# EAGLE design Reflect (EAGLE 6.3)
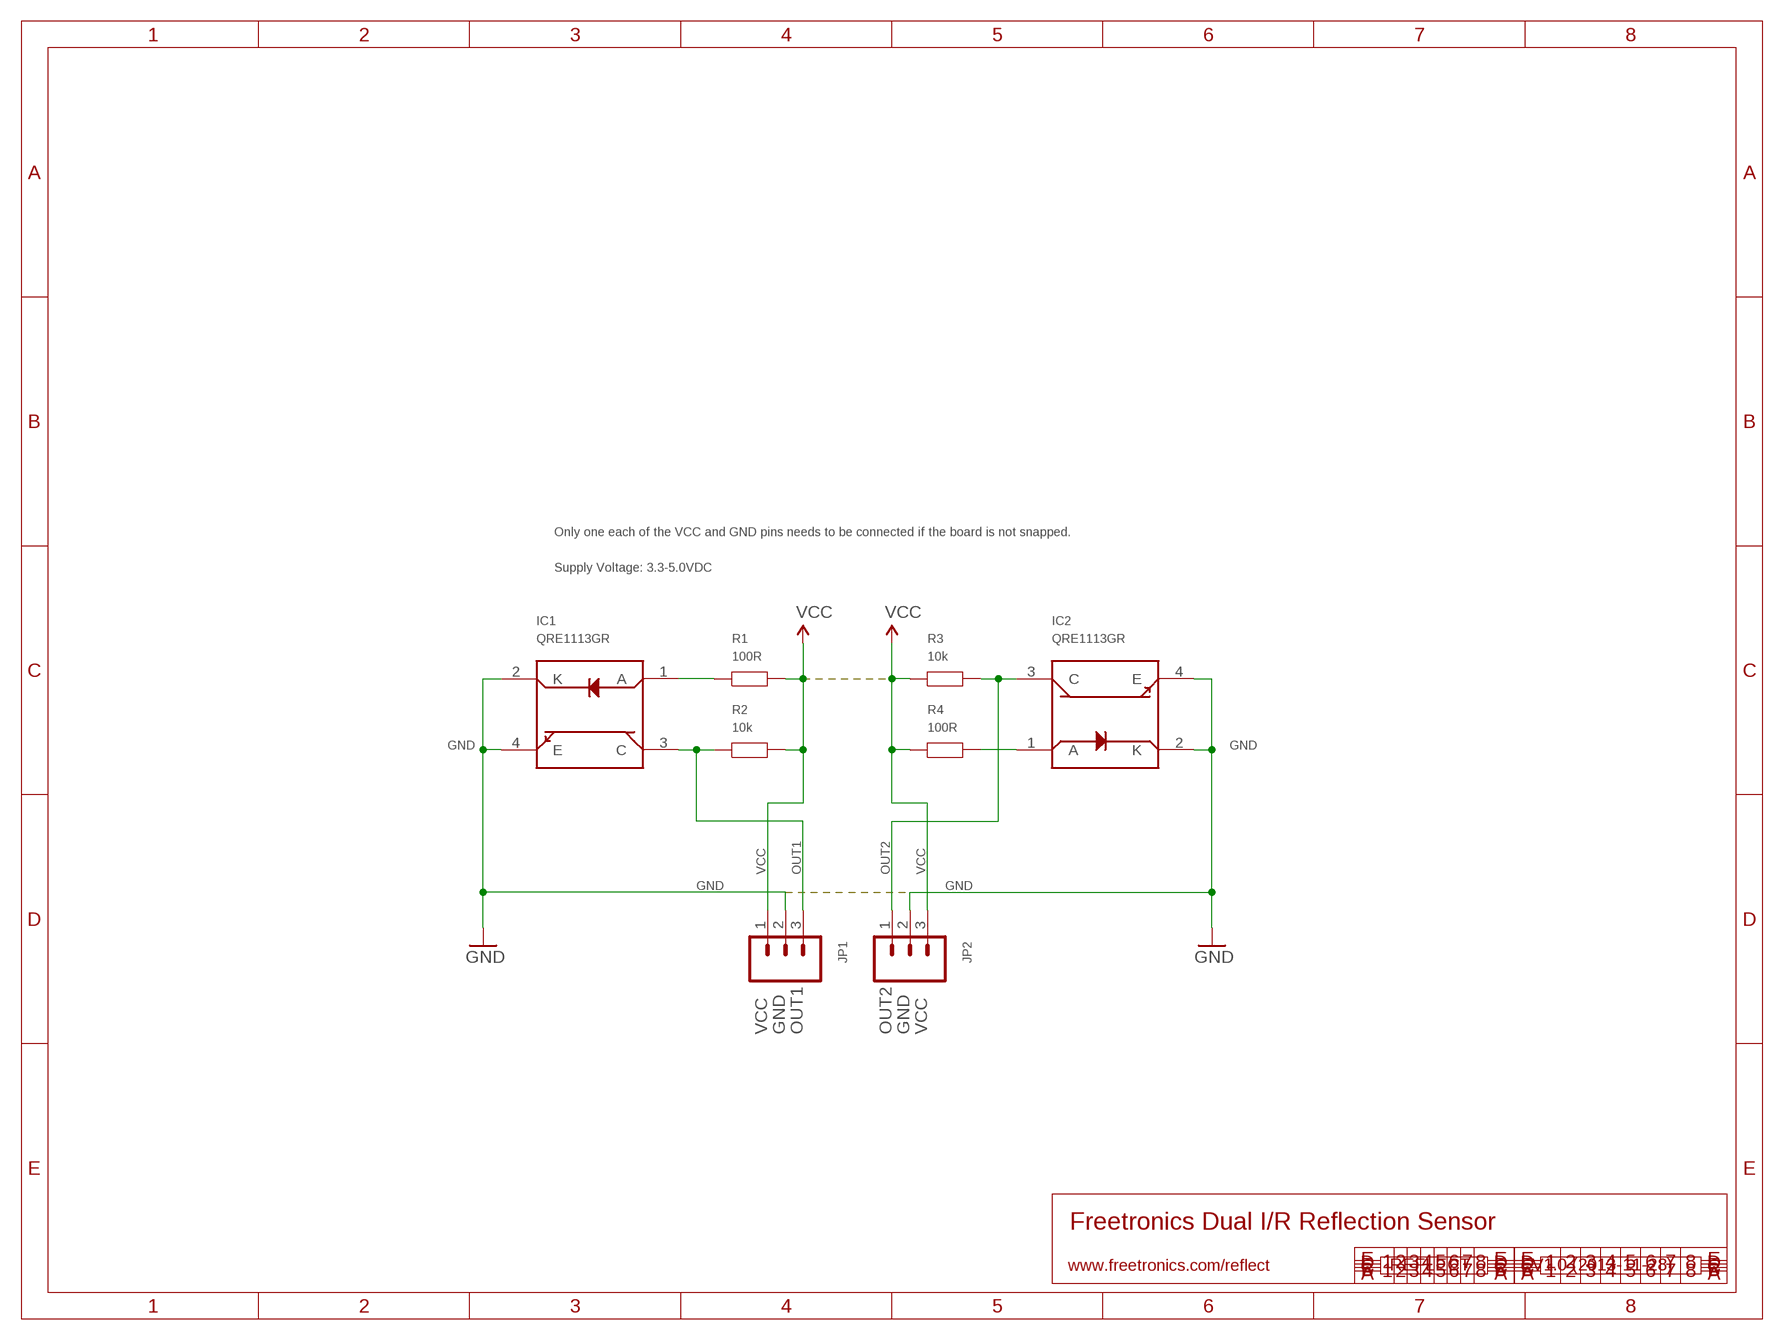
[diagram p0: schematic, sheet 1]

## Parts
IC1  QRE1113GR  [QRE1113GR]
IC2  QRE1113GR  [QRE1113GR]
JP1  M03PTH  [1X03]
JP2  M03PTH  [1X03]
R1  100R  RESISTOR0603  [0603]
R2  10k  RESISTOR0603  [0603]
R3  10k  RESISTOR0603  [0603]
R4  100R  RESISTOR0603  [0603]

## Nets
GND: IC1.2(K) IC1.4(E) IC2.2(K) IC2.4(E) JP1.2 JP2.2
N$1: IC1.1(A) R1.1
N$3: IC2.1(A) R4.2
OUT1: IC1.3(C) JP1.3 R2.1
OUT2: IC2.3(C) JP2.1 R3.2
VCC: JP1.1 JP2.3 R1.2 R2.2 R3.1 R4.1

## Notes on the sheet
- Only one each of the VCC and GND pins needs to be connected if the board is not snapped.
- Supply Voltage: 3.3-5.0VDC
- VCC | GND | OUT1 | OUT2 | GND | VCC
- Freetronics Dual I/R Reflection Sensor
- www.freetronics.com/reflect | REFLECT | V1.0 (2013-11-28)

## Library data of the parts
IC1 IC2 = freetronics-original:QRE1113GR
JP1 JP2 = freetronics-original:M03: Header 3 Standard 3-pin 0.1" header. Use with straight break away headers (SKU : PRT-00116), right angle break away headers (PRT-00553), swiss pins (PRT-00743), machine pins (PRT-00117), and female headers (PRT-00115). Molex polarized connector foot print use with SKU : PRT-08232 with associated crimp pins and housings.
R1-R4 = freetronics-original:RESISTOR: Resistor Basic schematic elements and footprints for 0603, 1206, and PTH 1/10th watt (small) resistors.

## Board
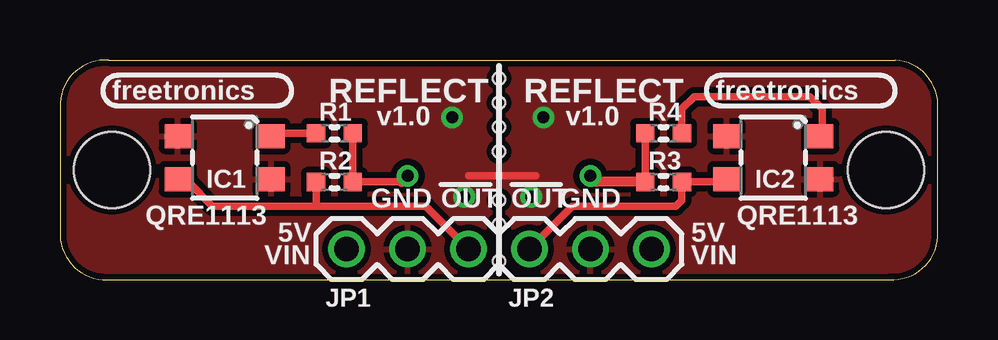
[diagram p1: board, top side]
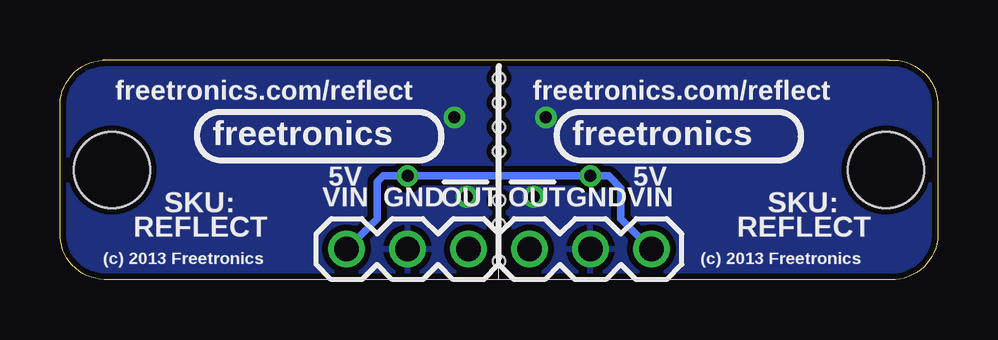
[diagram p2: board, bottom side, seen from below]

Size 36.58 x 9.15 mm. Coordinates in mm from the lower left corner, seen from the top.
Outline: 0,2.04 arc90 1.78,0 34.55,0 arc90 36.58,1.78 36.58,7.12 arc90 34.8,9.15 2.04,9.15 arc90 0,7.37 0,2.04
Copper layers (1*16): Top 0.035mm / dielectric 1.5mm / Bottom 0.035mm
Design rules "default *": minimum track width 8mil, minimum drill 15mil, track to track 10mil, track to pad 10mil, pad to pad 10mil, via to via 10mil, smd to smd 8mil, copper to edge 10mil, drill to drill 8mil, minimum pad ring 10mil, minimum via ring 8mil, stop-mask expansion 4mil, vias tented up to drill 25mil, thermal gap 10mil
Holes 3.17 mm at 2.16,4.58 34.42,4.58
Holes 0.5 mm at 18.29,8.39 18.29,7.37 18.29,6.35 18.29,5.34 18.29,3.31 18.29,2.29 18.29,0.77

### Footprints (pad centres in the part's own frame; a part is rotated, then mirrored left to right if it is on the bottom)
QRE1113GR = smd 1.1 x 1: 1 -1.95,-0.9; 2 1.95,-0.9; 3 1.95,0.9; 4 -1.95,0.9
1X03 = drill 1.016: 1 0,0; 2 2.54,0; 3 5.08,0
0603 = smd 0.762 x 0.762: 1 -0.762,0; 2 0.762,0

### Placement (x,y rotation side)
IC1  6.86,5.08 180 top
IC2  29.72,5.08 180 top
JP1  11.94,1.27 180 bottom
JP2  19.56,1.27 180 bottom
R1  11.43,6.1 0 top
R2  11.43,4.07 0 top
R3  25.15,4.07 0 top
R4  25.15,6.1 0 top

### Tracks (layer width: path | path; a pad name or v marks a point on that pad's centre or on a via)
GND  (via drill 0.5)
  Top 0.305: 19.82,4.32 17.02,4.32
  other vias: 16.34,6.76 19.64,3.46 16.84,3.46 20.15,6.76
  pour Top: 19.31,9.15 36.58,9.15 36.58,0 18.55,0 18.55,9.15
  pour Bottom: 18.55,9.15 36.58,9.15 36.58,0 18.55,0
  pour Top: 0,9.15 18.04,9.15 18.04,0 0,0
  pour Bottom: 0.77,9.15 18.04,9.15 18.04,0 0,0 0,9.15
N$1
  Top 0.305: R1.1 8.93,6.1
  Top 0.406: IC1.1 8.93,6.1
N$3
  Top 0.305: 31.75,5.98 31.75,7.12 31.25,7.62 26.42,7.62 25.91,7.12 R4.2
  Top 0.406: IC2.1 31.75,5.98
OUT1
  Top 0.305: 5.34,4.07 6.35,3.05 10.67,3.05 | 10.67,3.05 15.24,3.05 JP1.3 | R2.1 10.67,3.05
  Top 0.406: 5.34,4.07 5.08,4.07 4.97,4.18 IC1.3
OUT2
  Top 0.305: 27.66,4.07 R3.2 25.91,3.31 25.66,3.05 21.34,3.05 JP2.1
  Top 0.406: 27.66,4.07 IC2.3
VCC  (via drill 0.5)
  Top 0.305: R1.2 R2.2 14.23,4.07 | R3.1 R4.1
  Top 0.406: 14.23,4.07 v14.48,4.32 | R3.1 22.36,4.07 v22.1,4.32
  Bottom 0.305: JP2.3 23.37,2.54 23.37,4.07 23.12,4.32 v22.1,4.32 v14.48,4.32 13.72,4.32 13.21,3.81 13.21,2.54 JP1.1

### Text on the board
tPlace: freetronics | REFLECT | REFLECT | freetronics | v1.0 | v1.0 | GND | GND | OUT | OUT | QRE1113 | 5V | 5V | QRE1113 | VIN | VIN
bPlace: freetronics.com/reflect | freetronics.com/reflect | freetronics | freetronics | 5V | 5V | SKU: | VIN | GND | OUT | OUT | GND | VIN | SKU: | REFLECT | REFLECT | (c) 2013 Freetronics | (c) 2013 Freetronics